# EasyEDA schematic SCH_ESP-Mar_2024-04-21 (1).json

## Sheets
1 Sheet_1: TITLE: ESP 32 Mar; REV: 1.0; Date: 2024; Sheet: 1/1; Drawn By: Karman B; Company: Bhatti Enterprises
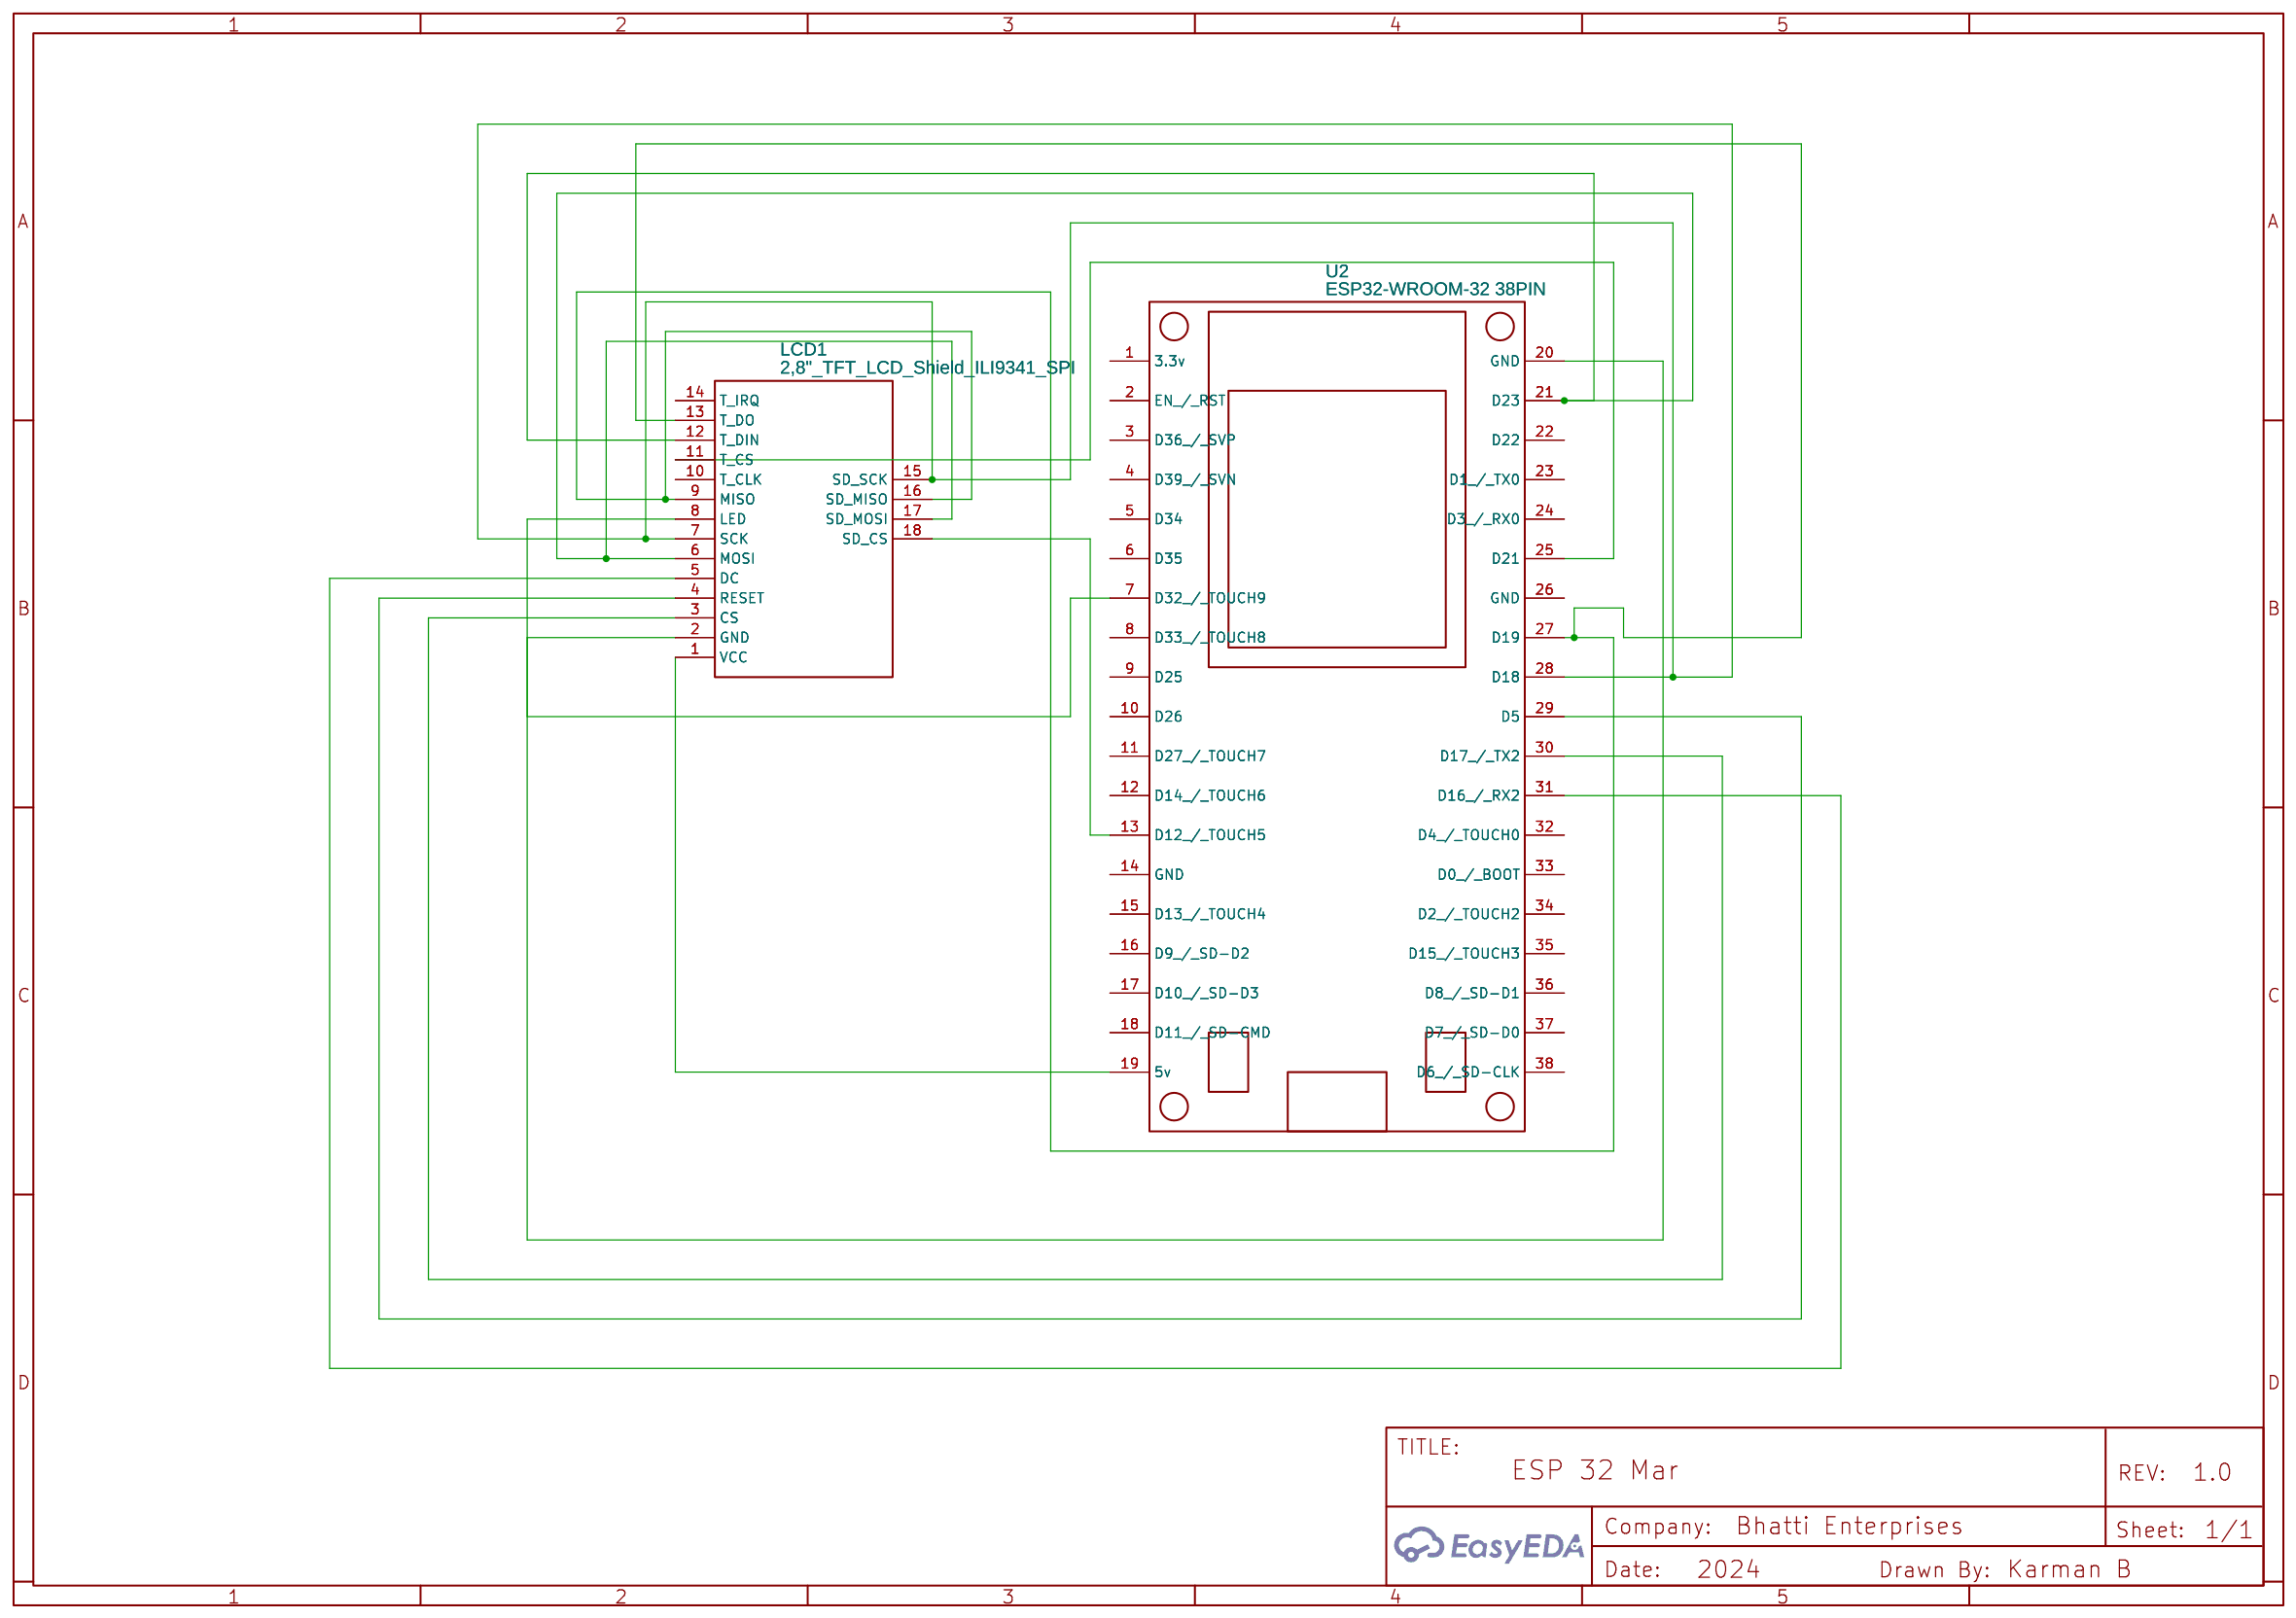
[diagram p0: Sheet_1]
2 Sheet SMOL: Date: 2024-02-21
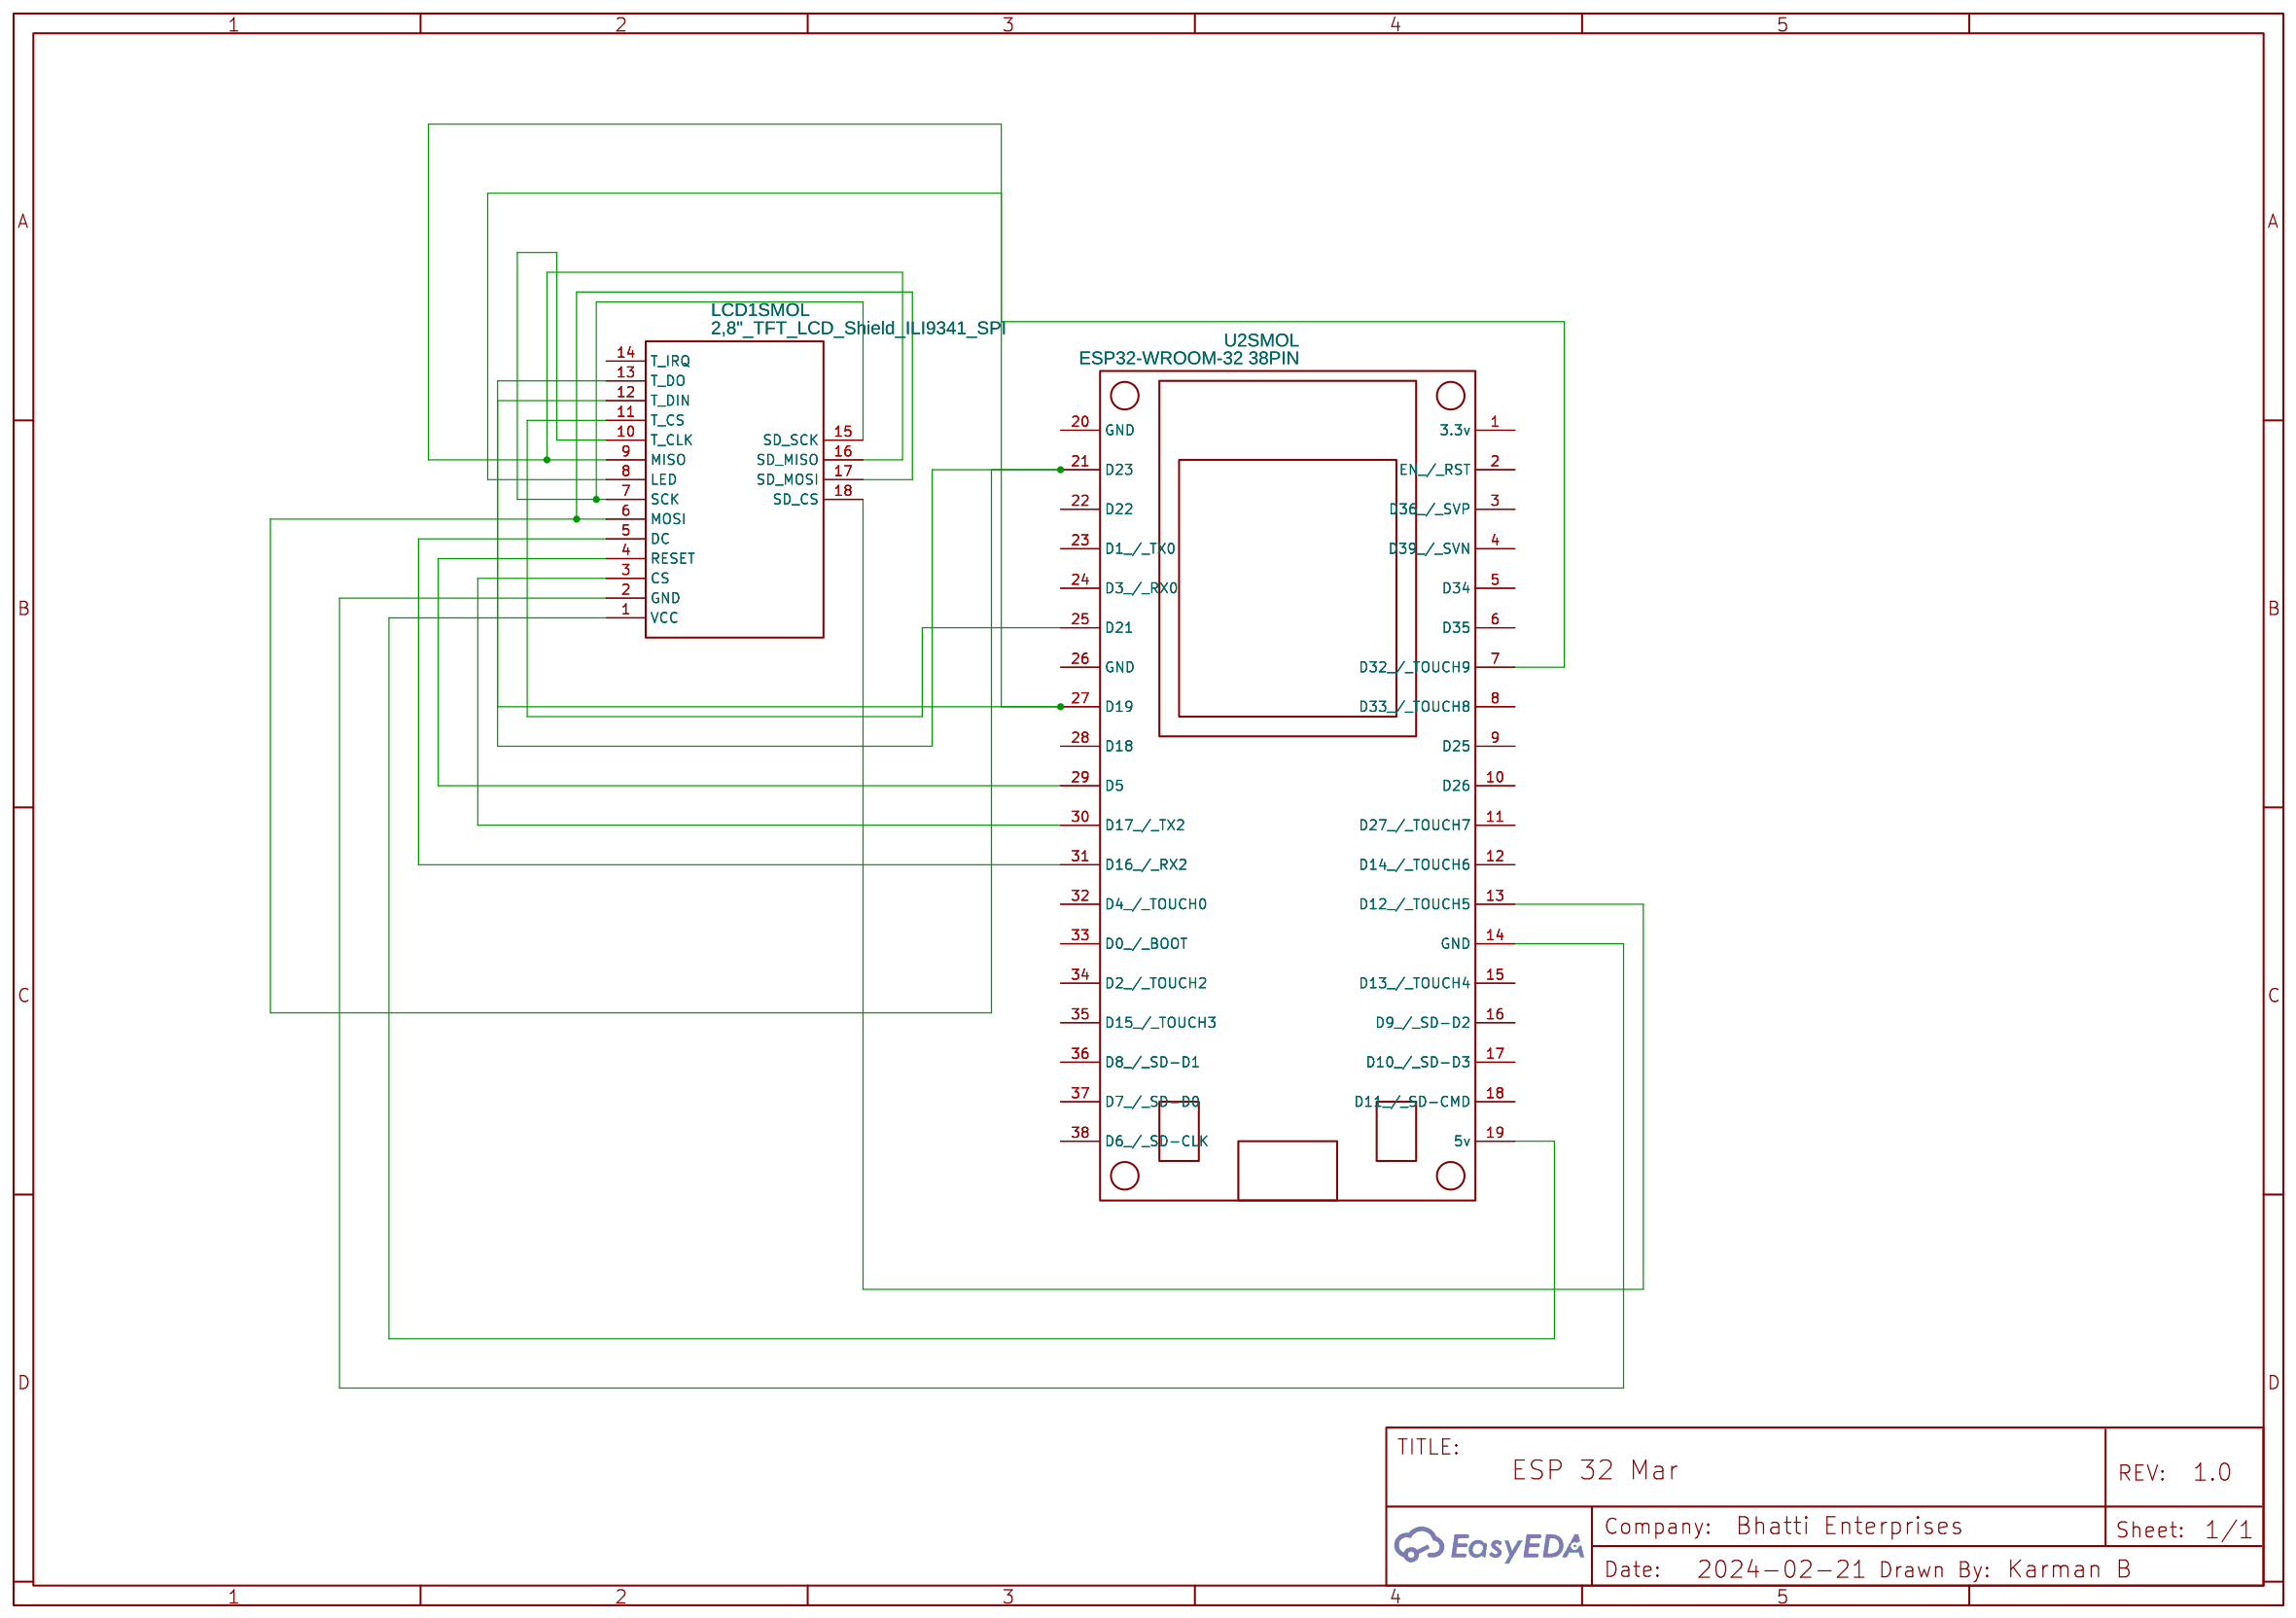
[diagram p1: Sheet SMOL]

## Parts
sheet Sheet SMOL
LCD1SMOL  2,8"_TFT_LCD_Shield_ILI9341_SPI  [SPI_ILI9341]
U2SMOL  ESP32-WROOM-32 38PIN  [ESP32 DEVELOPMENT BOARD V1]
sheet Sheet_1
LCD1  2,8"_TFT_LCD_Shield_ILI9341_SPI  [SPI_ILI9341]
U2  ESP32-WROOM-32 38PIN  [ESP32 DEVELOPMENT BOARD V1]

## Library data of the parts
LCD1 LCD1SMOL = 2,8"_TFT_LCD_Shield_ILI9341_SPI: Contributor: freddyka
U2 U2SMOL = ESP32-WROOM-32 38PIN: Manufacturer Part: ESP32 Development Board; Contributor: asshoe3214

## Nets
Net-(LCD1-1): LCD1.1(VCC) U2.19(5v)
Net-(LCD1-2): LCD1.2(GND) U2.20(GND)
Net-(LCD1-3): LCD1.3(CS) U2.30(D17 / TX2)
Net-(LCD1-4): LCD1.4(RESET) U2.29(D5)
Net-(LCD1-5): LCD1.5(DC) U2.31(D16 / RX2)
Net-(LCD1-6): LCD1.6(MOSI) LCD1.12(T_DIN) LCD1.17(SD_MOSI) U2.21(D23)
Net-(LCD1-7): LCD1.7(SCK) LCD1.15(SD_SCK) U2.28(D18)
Net-(LCD1-8): LCD1.8(LED) U2.7(D32 / TOUCH9)
Net-(LCD1-9): LCD1.9(MISO) LCD1.13(T_DO) LCD1.16(SD_MISO) U2.27(D19)
Net-(LCD1-11): LCD1.11(T_CS) U2.25(D21)
Net-(LCD1-18): LCD1.18(SD_CS) U2.13(D12 / TOUCH5)
Net-(LCD1SMOL-1): LCD1SMOL.1(VCC) U2SMOL.19(5v)
Net-(LCD1SMOL-2): LCD1SMOL.2(GND) U2SMOL.14(GND)
Net-(LCD1SMOL-3): LCD1SMOL.3(CS) U2SMOL.30(D17 / TX2)
Net-(LCD1SMOL-4): LCD1SMOL.4(RESET) U2SMOL.29(D5)
Net-(LCD1SMOL-5): LCD1SMOL.5(DC) U2SMOL.31(D16 / RX2)
Net-(LCD1SMOL-6): LCD1SMOL.6(MOSI) LCD1SMOL.12(T_DIN) LCD1SMOL.17(SD_MOSI) U2SMOL.21(D23)
Net-(LCD1SMOL-7): LCD1SMOL.7(SCK) LCD1SMOL.10(T_CLK) LCD1SMOL.15(SD_SCK)
Net-(LCD1SMOL-8): LCD1SMOL.8(LED) U2SMOL.7(D32 / TOUCH9)
Net-(LCD1SMOL-9): LCD1SMOL.9(MISO) LCD1SMOL.13(T_DO) LCD1SMOL.16(SD_MISO) U2SMOL.27(D19)
Net-(LCD1SMOL-11): LCD1SMOL.11(T_CS) U2SMOL.25(D21)
Net-(LCD1SMOL-18): LCD1SMOL.18(SD_CS) U2SMOL.13(D12 / TOUCH5)

Not connected (* = marked no-connect by the designer): LCD1 10(T_CLK) 14(T_IRQ); LCD1SMOL 14(T_IRQ); U2 1(3.3v) 2(EN / RST) 3(D36 / SVP) 4(D39 / SVN) 5(D34) 6(D35) 8(D33 / TOUCH8) 9(D25) 10(D26) 11(D27 / TOUCH7) 12(D14 / TOUCH6) 14(GND) 15(D13 / TOUCH4) 16(D9 / SD-D2) 17(D10 / SD-D3) 18(D11 / SD-CMD) 22(D22) 23(D1 / TX0) 24(D3 / RX0) 26(GND) 32(D4 / TOUCH0) 33(D0 / BOOT) 34(D2 / TOUCH2) 35(D15 / TOUCH3) 36(D8 / SD-D1) 37(D7 / SD-D0) 38(D6 / SD-CLK); U2SMOL 1(3.3v) 2(EN / RST) 3(D36 / SVP) 4(D39 / SVN) 5(D34) 6(D35) 8(D33 / TOUCH8) 9(D25) 10(D26) 11(D27 / TOUCH7) 12(D14 / TOUCH6) 15(D13 / TOUCH4) 16(D9 / SD-D2) 17(D10 / SD-D3) 18(D11 / SD-CMD) 20(GND) 22(D22) 23(D1 / TX0) 24(D3 / RX0) 26(GND) 28(D18) 32(D4 / TOUCH0) 33(D0 / BOOT) 34(D2 / TOUCH2) 35(D15 / TOUCH3) 36(D8 / SD-D1) 37(D7 / SD-D0) 38(D6 / SD-CLK)
